# EAGLE design Joystick (EAGLE 7.3.0)
Assembly variants: standard
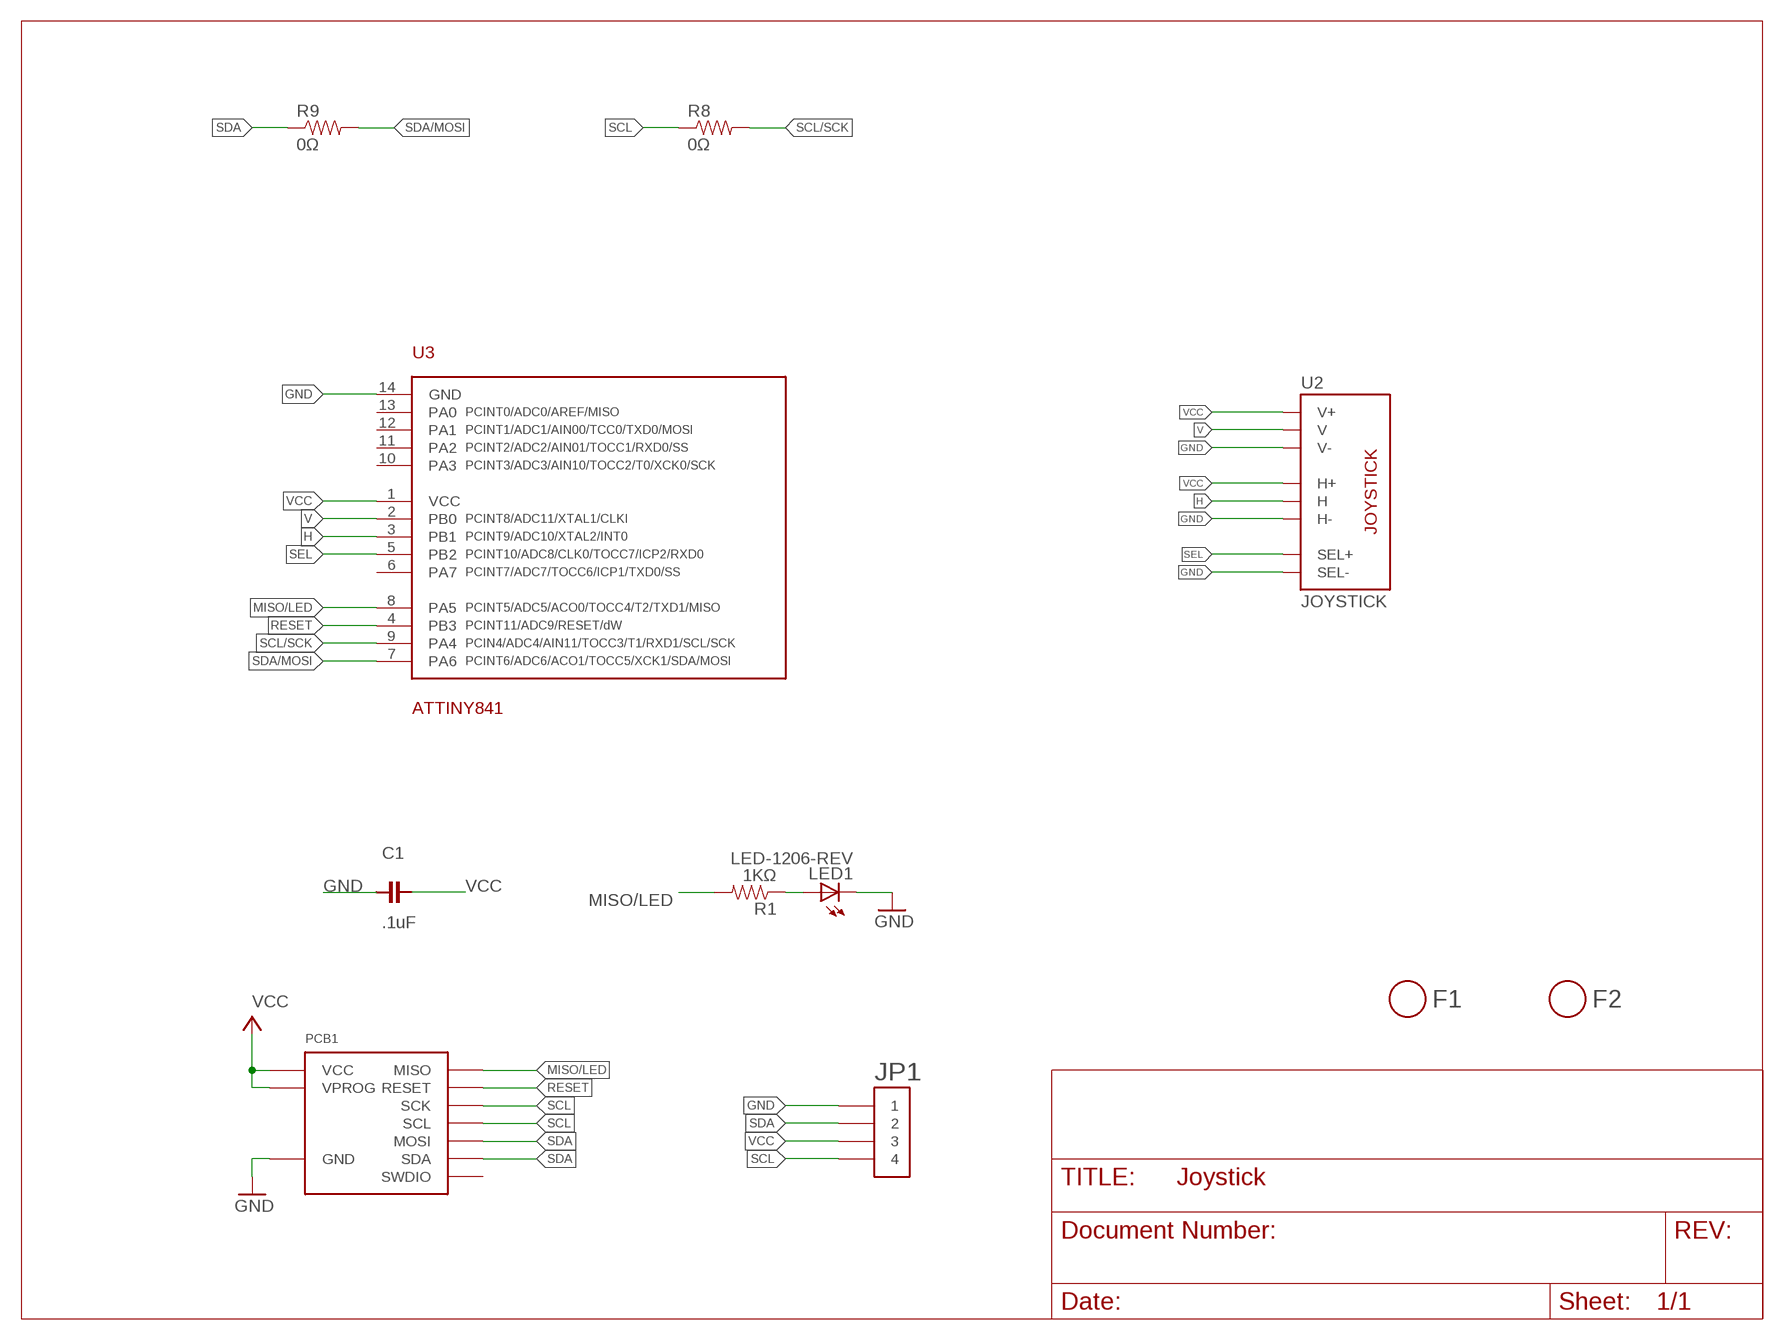
[diagram p0: schematic, sheet 1]
FRAME1 (LETTER_L): BOM: EXCLUDE

## Parts
C1  .1uF  CAPACITOR-.1UF  [0603]
F1  FIDUCIAL  [FIDUCIAL_1MM]
F2  FIDUCIAL  [FIDUCIAL_1MM]
JP1  HEADER-1X4-AMPMODU  [AMPMODU-4P]
LED1  LED-1206-REV  [LED-1206-REV]
PCB1  DEVICE-PCB  [DEVICE-PCB]
R1  1KΩ  RESISTOR-1KΩ  [0603]
R8  0Ω  RESISTOR-0Ω  [0603]
R9  0Ω  RESISTOR-0Ω  [0603]
U2  JOYSTICK  [JOYSTICK]
U3  ATTINY841  [SOIC-14]

## Nets
GND: C1.2 JP1.P$1 JP1.P$2 LED1.C PCB1.GND U2.B2A(SEL-) U2.H3(H-) U2.V3(V-) U3.14(GND)
H: U2.H2(H) U3.3(PB1)
MISO/LED: PCB1.MISO R1.2 U3.8(PA5)
N$1: LED1.A R1.1
RESET: PCB1.RESET U3.4(PB3)
SCL: JP1.P$7 JP1.P$8 PCB1.CLK(SCK) PCB1.SCL R8.1
SCL/SCK: R8.2 U3.9(PA4)
SDA: JP1.P$3 JP1.P$4 PCB1.MOSI PCB1.SDA R9.1
SDA/MOSI: R9.2 U3.7(PA6)
SEL: U2.B1A(SEL+) U3.5(PB2)
V: U2.V2(V) U3.2(PB0)
VCC: C1.1 JP1.P$5 JP1.P$6 PCB1.VCC PCB1.VPROG U2.H1(H+) U2.V1(V+) U3.1(VCC)
Unconnected: PCB1.SWDIO U3.6(PA7) U3.10(PA3) U3.11(PA2) U3.12(PA1) U3.13(PA0)

## Library data of the parts
C1 = Modulo:CAPACITOR: Capacitor; PARTNUM: C0603C104K5RACTU
F1 F2 = Modulo:FIDUCIAL; BOM: EXCLUDE
JP1 = Modulo:HEADER-1X4; PARTNUM: 147721-3
LED1 = Modulo:LED: LED; PARTNUM: LTST-C230TBKT
PCB1 = Modulo:DEVICE-PCB: Modulo Footprint; NOBOM: 1; PARTNUM: Joystick PCB
R1 = Modulo:RESISTOR: Resistor Basic schematic elements and footprints for 0603, 1206, and PTH resistors.; PARTNUM: ERJ-3EKF1001V
R8 R9 = Modulo:RESISTOR: Resistor Basic schematic elements and footprints for 0603, 1206, and PTH resistors.; PARTNUM: ERJ-3GEY0R00V
U2 = Modulo:JOYSTICK: Thumb Joystick Joystick commonly found in PS2 controllers. Two pots and a select switch. Footprint proven. Spark Fun Electronics SKU : COM-09032; PARTNUM: Joystick
U3 = Modulo:ATTINY841; PARTNUM: ATTINY841-SSUR

## Board
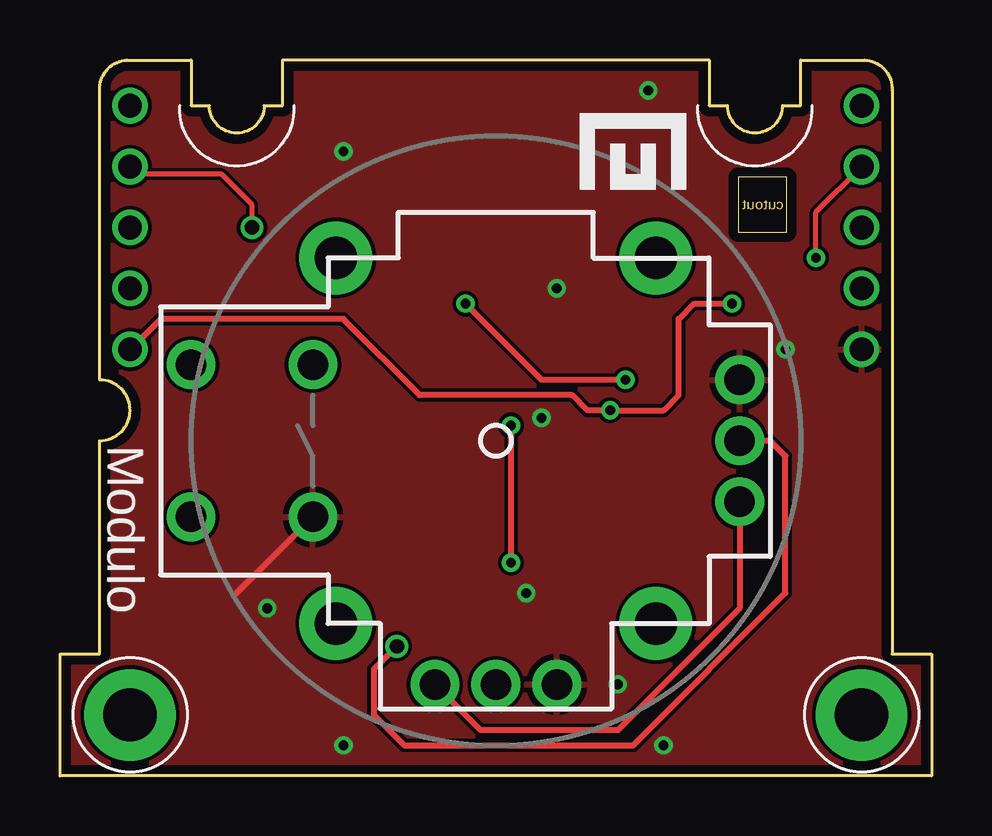
[diagram p1: board, top side]
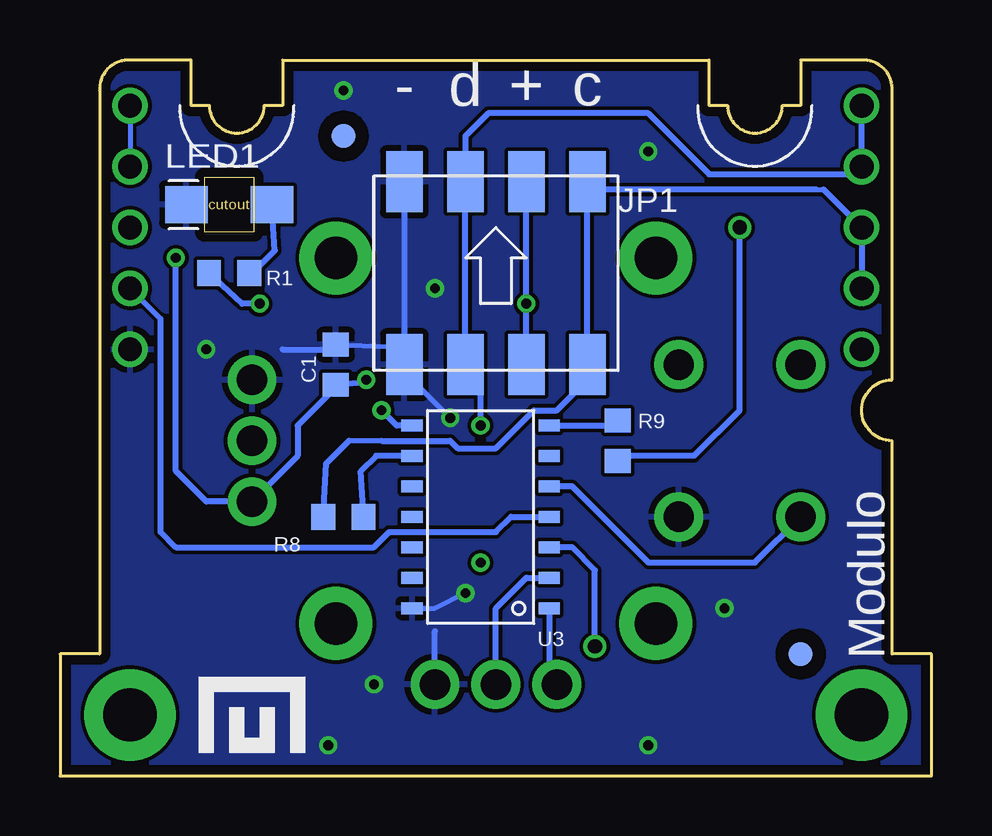
[diagram p2: board, bottom side, seen from below]

Size 36.32 x 29.84 mm. Coordinates in mm from the lower left corner, seen from the top.
Copper layers (1*16): Top 0.0356mm / dielectric 1.5011mm / Bottom 0.0356mm
Design rules "Modulo": minimum track width 6mil, minimum drill 13mil, track to track 6mil, track to pad 6mil, pad to pad 6mil, via to via 6mil, smd to smd 6mil, copper to edge 15mil, drill to drill 6mil, minimum pad ring 7mil, minimum via ring 7mil, stop-mask expansion 3mil, vias tented up to drill 25mil, thermal gap 10mil

### Footprints (pad centres in the part's own frame; a part is rotated, then mirrored left to right if it is on the bottom)
0603 = smd 0.991 x 1.092: 1 -0.838,0; 2 0.838,0
FIDUCIAL_1MM = smd 1 x 1: 1 0,0
AMPMODU-4P = smd 1.524 x 2.54: P$1 -3.81,3.81; P$2 -3.81,-3.81; P$3 -1.27,3.81; P$4 -1.27,-3.81; P$5 1.27,3.81; P$6 1.27,-3.81; P$7 3.81,3.81; P$8 3.81,-3.81
LED-1206-REV = smd 1.778 x 1.524: A -1.778,0; C 1.778,0
DEVICE-PCB = drill 0.991: CLK 2.54,20.32; GND 33.02,17.78; MISO 2.54,17.78; MOSI 2.54,25.4; RESET 33.02,20.32; SCL 2.54,22.86; SDA 2.54,27.94; SWDIO 33.02,22.86; VCC 33.02,25.4; VPROG 33.02,27.94 | drill 2.223 pad 3.81: P$1 2.54,2.54; P$2 33.02,2.54
JOYSTICK = drill 1.27 pad 2.032: B1A -3.175,12.7; B1B 3.175,12.7; B2A -3.175,7.62; B2B 3.175,7.62; H1 -2.54,-10.16; H2 0,-10.16; H3 2.54,-10.16; V1 -10.16,2.54; V2 -10.16,0; V3 -10.16,-2.54 | drill 1.778 pad 3.048: MOUNT1 -7.62,6.668; MOUNT2 -7.62,-6.668; MOUNT4 7.62,6.668; MOUNT5 7.62,-6.668
SOIC-14 = smd 0.508 x 0.889: 1 0,-3.175; 2 1.27,-3.175; 3 2.54,-3.175; 4 3.81,-3.175; 5 5.08,-3.175; 6 6.35,-3.175; 7 7.62,-3.175; 8 7.62,2.54; 9 6.35,2.54; 10 5.08,2.54; 11 3.81,2.54; 12 2.54,2.54; 13 1.27,2.54; 14 0,2.54

### Placement (x,y rotation side)
C1  24.83,17.14 90 bottom
F1  5.46,5.08 0 bottom
F2  24.51,26.67 0 bottom
JP1  18.16,20.95 0 bottom
LED1  29.27,23.81 180 bottom
PCB1  0.38,0 0 top
R1  29.27,20.95 180 bottom
R8  24.51,10.79 0 bottom
R9  13.08,13.97 90 bottom
U2  18.16,13.97 90 top
U3  19.11,6.99 90 bottom
U$1  [LOGO-SMALL]  28.64,1.59 0 bottom
U$2  [LOGO-SMALL]  23.56,25.08 0 top

### Tracks (layer width: path | path; a pad name or v marks a point on that pad's centre or on a via)
GND  (via drill 0.41)
  Top 0.254: 7.37,7.62 U2.B2A
  Bottom 0.203: U3.14 20.7,6.99 v19.43,7.62 | 21.97,16.19 21.34,16.19 v20.07,14.92 | C1.2 22.06,17.87 21.97,17.78
  Bottom 0.254: 27.05,17.78 24.92,17.78 C1.2 | JP1.P$1 21.97,17.78 JP1.P$2 21.97,16.19 | U2.V3 20.7,6.03
  other vias: 30.23,17.78 24.51,28.57 20.7,20.32 23.24,3.81 11.81,1.27 8.64,6.99 11.81,26.04 25.15,1.27
  pour Top: 35.94,0 0.38,0 0.38,30.48 35.94,30.48
  pour Bottom: 35.94,0 0.38,0 0.38,30.48 35.94,30.48
H  (via drill 0.6)
  Top 0.254: v14.03,5.4 13.08,4.45 13.08,2.54 14.35,1.27 23.88,1.27 30.23,7.62 30.23,13.34 29.59,13.97 U2.H2
  Bottom 0.254: v14.03,5.4 14.03,8.57 14.99,9.53 U3.3
MISO/LED  (via drill 0.41)
  Top 0.254: v28,19.68 26.42,19.68 25.78,19.05 25.78,15.88 25.15,15.24 v22.92,15.24 21.97,15.24 21.34,15.88 14.99,15.88 11.81,19.05 4.19,19.05 PCB1.MISO
  Bottom 0.254: U3.8 22.29,14.61 v22.92,15.24 | v28,19.68 28.73,19.68 R1.2
N$1
  Bottom 0.203: R1.1 28.32,20.95
  Bottom 0.254: 28.32,20.95 27.37,21.91 LED1.A
RESET
  Bottom 0.203: 32.13,19.05 PCB1.RESET
  Bottom 0.254: U3.4 17.53,10.79 18.16,10.16 22.61,10.16 23.24,9.53 31.5,9.53 32.13,10.16 32.13,19.05
SCL
  Bottom 0.203: 4.83,24.45 4.51,24.45 | 22.92,13.97 24.29,13.97
  Bottom 0.254: 4.83,24.45 14.03,24.45 JP1.P$7 JP1.P$8 14.35,16.51 15.62,15.24 16.57,15.24 18.16,13.65 19.75,13.65 20.07,13.97 22.92,13.97 | R8.1 25.24,13.02 24.29,13.97 | 4.51,24.45 PCB1.SCL PCB1.CLK
SCL/SCK
  Bottom 0.254: R8.2 23.79,12.7 23.15,13.34 U3.9
SDA  (via drill 0.41, 0.6)
  Top 0.203: v8,22.86 8,23.81 6.73,25.08 3.24,25.08 PCB1.MOSI
  Top 0.254: v18.8,8.89 v18.8,14.61
  Bottom 0.203: 18.8,16.51 JP1.P$4 | R9.1 13.08,13.34
  Bottom 0.254: JP1.P$4 JP1.P$3 19.43,26.67 18.48,27.62 11.81,27.62 9.27,25.08 3.24,25.08 PCB1.MOSI PCB1.SDA | v8,22.86 8,15.24 9.91,13.34 12.67,13.34 R9.1 | v18.8,14.61 18.8,16.51
SDA/MOSI
  Bottom 0.203: 13.17,14.61 R9.2
  Bottom 0.254: U3.7 14.76,14.61 13.17,14.61
SEL
  Bottom 0.254: U2.B1A 7.37,8.89 11.81,8.89 14.99,12.06 U3.5
V
  Bottom 0.254: U2.V2 18.16,6.99 16.89,8.26 U3.2
VCC  (via drill 0.41)
  Top 0.203: v31.5,21.59 31.5,23.5 PCB1.VCC
  Top 0.254: U2.H1 28.32,6.99 23.24,1.91 17.53,1.91 U2.V1 | v23.56,16.51 20.07,16.51 v16.89,19.68
  Bottom 0.203: PCB1.VPROG PCB1.VCC
  Bottom 0.254: JP1.P$6 v16.89,19.68 JP1.P$5 | U3.1 15.94,4.13 U2.V1 | v23.56,16.51 23.65,16.42 C1.1 24.83,16.19 26.42,14.61 26.42,13.34 U2.H1 30.23,11.43 31.5,12.7 v31.5,21.59